# EasyEDA Pro project RM_超级电容控制板.eprj, board PCB_超电控制板
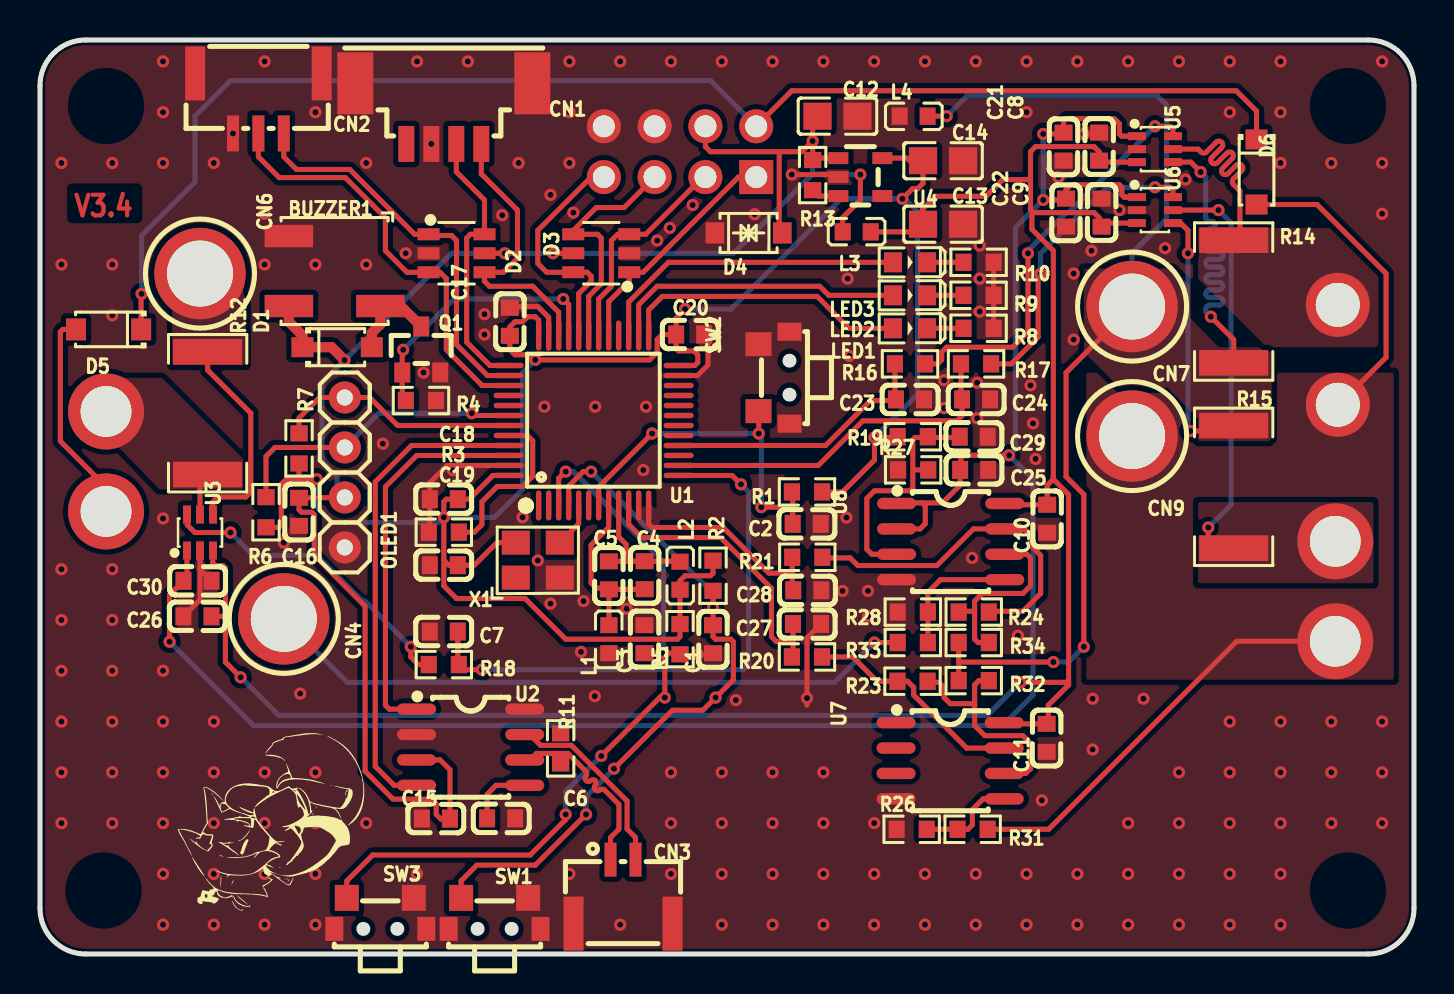
[diagram p3: board, top side]
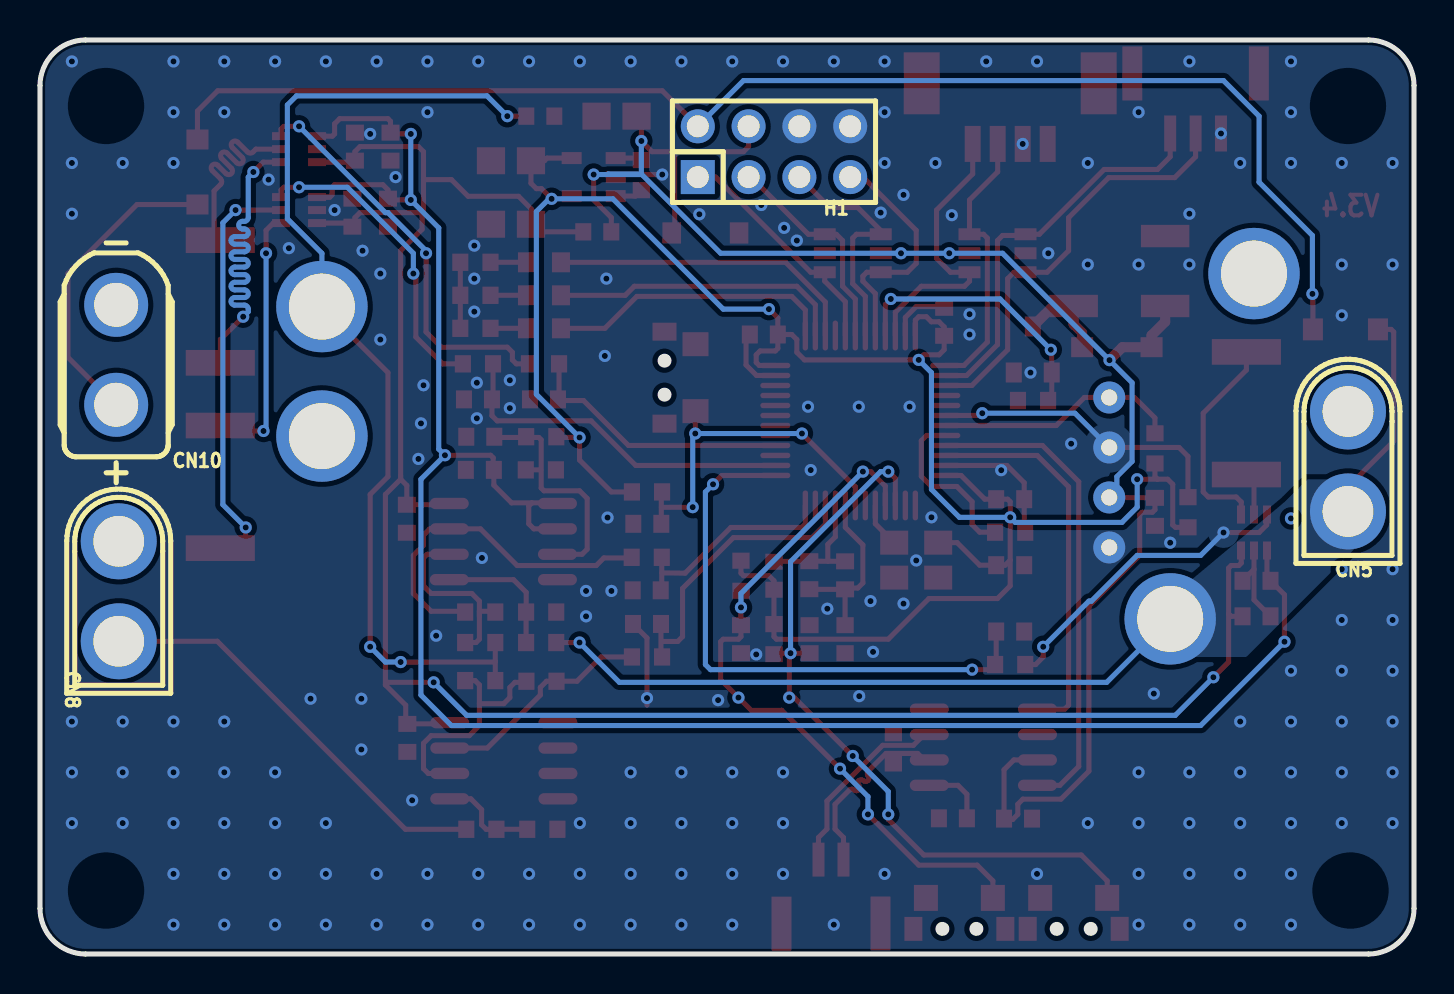
[diagram p4: board, bottom side, seen from below]

Outline 68.71 x 45.72 mm; copper layers: Top Layer, Bottom Layer. Coordinates in mm from the lower left corner of the outline.
Outline path: 0,43.43 arc(0.67,45.05) 2.29,45.72 66.42,45.72 arc(68.04,45.05) 68.71,43.43 68.71,2.29 arc(68.04,0.67) 66.42,0 2.29,0 arc(0.67,0.67) 0,2.29 0,43.43
Stack: Top Layer 0.035mm / Dielectric1 1.51mm FR4 er 4.5 / Bottom Layer 0.035mm

## Design rules (mm)
spacing Default (default): track to track 0.152, other pairs 0 to 0.152
track width Default (default): min 0.254, default 0.254, max 25.4
differential pair differentialPair (default): width min 0.127, default 0.254, max 2.54; gap min 0.152, default 0.152
via Default (default): diameter min 0.61, default 0.61, max 100.025; hole min 0.305, default 0.305, max 59.995
net VCUP uses gge254627
net GND uses gge260350(1)
net PGND uses gge210927
net PGND_IN uses gge210933
net PGND_OUT uses gge210996
net VCC uses gge211044
net PGND_CUP_IN uses gge253829
net PGND_CUP uses gge254615
pour e100 uses gge254627
pour e734 uses gge253829
pour e735 uses gge254615

## Placement (name value [footprint] x y rotation side)
BUZZER1  MLT-5020  [BUZ-SMD_3P-L5.2-W5.2-P3.50-BR]  14.73 34.16 90 top
C1  1nF  [C0603]  33.66 15.75 90 top
C2  1uF  [C0603]  38.34 21.52 180 top
C3  1nF  [C0603]  30.23 15.75 270 top
C4  1nF  [C0603]  30.24 18.95 90 top
C5  100nF  [C0603]  28.45 18.94 90 top
C6  100nF  [C0603]  23.06 6.79 180 top
C7  2nF  [C0603]  20.19 16.13 0 top
C8  100nF  [C0603]  52.96 40.39 270 top
C9  100nF  [C0603]  53.09 37.08 270 top
C10  100nF  [C0603]  50.36 21.77 90 top
C11  100nF  [C0603]  50.34 10.81 90 top
C12  22uF  [C0805]  39.88 41.91 0 top
C13  22uF  [C0805]  45.16 36.5 0 top
C14  22uF  [C0805]  45.16 39.68 0 top
C15  100nF  [C0603]  19.8 6.77 0 top
C16  100nF  [C0603]  12.95 22.12 90 top
C17  100nF  [C0603]  23.5 31.62 270 top
C18  100nF  [C0603]  20.19 22.75 0 top
C19  100nF  [C0603]  20.19 19.45 0 top
C20  100nF  [C0603]  32.51 30.99 180 top
C21  100nF  [C0603]  51.18 40.39 90 top
C22  100nF  [C0603]  51.31 37.08 90 top
C23  2nF  [C0603]  43.5 27.74 180 top
C24  2nF  [C0603]  46.81 27.74 180 top
C25  100nF  [C0603]  46.71 24.22 0 top
C26  100nF  [C0603]  7.87 16.89 0 top
C27  2nF  [C0603]  38.35 16.51 180 top
C28  2nF  [C0603]  38.37 18.19 180 top
C29  100nF  [C0603]  46.69 25.88 180 top
C30  100nF  [C0603]  7.87 18.67 180 top
CN1  1.25-4PWB  [CONN-SMD_1.25-4PWB]  20.19 42.04 180 top
CN2  GH1.25-3PWBPZ  [CONN-SMD_GH1.25-3PWBPZ]  10.92 42.55 180 top
CN3  GH1.25-2PWBPZ  [CONN-SMD_GH1.25-2PWBPZ]  29.15 3.12 0 top
CN4  m3焊盘  [M3焊盘]  12.19 16.76 90 top
CN5  XT30U-M  [CONN-TH_XT30U-M]  3.3 24.64 90 bottom
CN6  m3焊盘  [M3焊盘]  8 34.04 90 top
CN7  m3焊盘  [M3焊盘]  54.61 32.39 0 top
CN8  XT30U-M  [CONN-TH_XT30U-M]  64.77 18.14 90 bottom
CN9  m3焊盘  [M3焊盘]  54.61 25.91 0 top
CN10  XT30  [CONN-TH_XT30UPB-F]  64.9 29.97 90 bottom
D1  贴片二极管/JSPI3100A/SOD-123FL[捷捷微]  [SOD-123F_L2.7-W1.6-LS3.8-RD]  14.86 30.35 0 top
D2  IP4220CZ6  [SOT-23-6_L2.9-W1.6-P0.95-LS2.7-BL]  20.83 35.05 270 top
D3  IP4220CZ6  [SOT-23-6_L2.9-W1.6-P0.95-LS2.7-BL]  28.07 35.05 90 top
D4  SMFJ5.0CA  [SOD-123_L2.8-W1.8-LS3.7-BI]  35.43 36.07 180 top
D5  DSK310_C713648  [SOD-123_L2.7-W1.8-LS3.7-RD]  3.43 31.24 180 top
D6  DSK310_C713648  [SOD-123_L2.7-W1.8-LS3.7-RD]  60.83 39.12 270 top
H1  PZ254V-12-8P  [HDR-TH_8P-P2.54-V-M-R2-C4-S2.54]  32 40.13 180 bottom
L1  1m  [L0603]  28.45 15.75 90 top
L2  1m  [L0603]  32 18.92 270 top
L3  1m  [L0603]  40.84 36.12 0 top
L4  1m  [L0603]  43.69 41.91 180 top
LED1  LED-0603_R  [LED0603_RED]  43.5 31.3 0 top
LED2  LED-0603_G  [LED0603_RED]  43.51 32.95 0 top
LED3  LED-0603_B  [LED0603_RED]  43.51 34.6 0 top
OLED1  0.96OLED_4P_MODULE_JX  [排针2.54单排4PIN]  15.24 20.34 90 top
Q1  2N7002  [SOT-23_L2.9-W1.3-P0.95-LS2.4-BR]  19.06 30.24 270 top
R1  10k  [R0603]  38.35 23.11 180 top
R2  10k  [R0603]  33.66 18.92 90 top
R3  1k  [R0603]  20.19 21.1 180 top
R4  10k  [R0603]  19.05 27.69 180 top
R5  10k  [R0603]  32 15.75 90 top
R6  10k  [R0603]  11.3 22.1 90 top
R7  10k  [R0603]  12.95 25.29 90 top
R8  100  [R0603]  46.93 31.3 0 top
R9  100  [R0603]  46.93 32.95 0 top
R10  100  [R0603]  46.93 34.6 0 top
R11  120  [R0603]  26.03 10.29 270 top
R12  1mΩ  [R2512]  8.38 27.05 270 top
R13  10k  [R0603]  38.64 38.96 90 top
R14  1mΩ  [R2512]  59.69 32.64 90 top
R15  1mΩ  [R2512]  59.69 23.37 270 top
R16  160  [R0603]  43.5 29.52 0 top
R17  160  [R0603]  46.81 29.52 0 top
R18  160  [R0603]  20.19 14.48 180 top
R19  2k  [R0603]  43.64 25.88 0 top
R20  160  [R0603]  38.35 14.86 0 top
R21  160  [R0603]  38.37 19.84 0 top
R23  3k3  [R0603]  43.63 13.64 0 top
R24  3k3  [R0603]  46.69 17.1 180 top
R26  3k3  [R0603]  43.59 6.24 0 top
R27  2k  [R0603]  43.66 24.22 180 top
R28  3k3  [R0603]  43.65 17.1 0 top
R31  68k  [R0603]  46.64 6.24 180 top
R32  68k  [R0603]  46.69 13.68 180 top
R33  68k  [R0603]  43.65 15.58 0 top
R34  68k  [R0603]  46.69 15.58 0 top
SW1  TS24CA  [SW-SMD_TS24CA]  22.73 2.03 180 top
SW2  TS24CA  [SW-SMD_TS24CA]  36.7 28.83 270 top
SW3  TS24CA  [SW-SMD_TS24CA]  17.02 2.03 180 top
U1  STM32F334C8T6  [LQFP-48_L7.0-W7.0-P0.50-LS9.0-BL]  27.69 26.69 0 top
U2  TJA1050T/CM,118  [SOIC-8_L5.0-W4.0-P1.27-LS6.0-BL]  21.53 10.34 270 top
U3  INA199A2DCKR  [SOT-363_L2.0-W1.3-P0.65-LS2.1-BR]  8 21.08 270 top
U4  RT9193-33  [SOT-23-5_L2.9-W1.6-P0.95-LS2.8-BL]  41.02 38.86 270 top
U5  INA199A2DCKR  [SOT-363_L2.0-W1.3-P0.65-LS2.1-BR]  55.75 40.26 180 top
U6  INA199A2DCKR  [SOT-363_L2.0-W1.3-P0.65-LS2.1-BR]  55.75 37.21 180 top
U7  GS8552-SR  [SOIC-8_L5.0-W4.0-P1.27-LS6.0-BL]  45.51 9.67 270 top
U8  GS8552-SR  [SOIC-8_L5.0-W4.0-P1.27-LS6.0-BL]  45.54 20.63 270 top
X1  8MHz  [OSC-SMD_4P-L3.2-W2.5-BL]  24.89 19.7 0 top

## Footprints (pads in the part's own frame, mm; a bottom-side part is the same pattern mirrored in y, then rotated)
BUZ-SMD_3P-L5.2-W5.2-P3.50-BR
  rect 1.12x2.425 smd: 1(1.75,2.288) 2(-1.75,2.288) 3(-1.75,-2.288)
C0603
  rect 0.8x0.9 smd: 1(-0.7,0) 2(0.7,0)
C0805
  rect 1.41x1.35 smd: 1(-1,0) 2(1,0)
CONN-SMD_1.25-4PWB
  rect 0.8x1.8 smd: 1(-1.875,1.516) 2(-0.625,1.516) 3(0.625,1.516) 4(1.875,1.516)
  rect 1.8x3.1 smd: 5(-4.425,-1.516) 6(4.425,-1.516)
CONN-SMD_GH1.25-2PWBPZ
  rect 0.6x1.7 smd: 1(-0.625,1.602) 2(0.625,1.602)
  rect 1x2.7 smd: 3(2.475,-1.602) 4(-2.475,-1.598)
CONN-SMD_GH1.25-3PWBPZ
  rect 0.6x1.8 smd: 1(-1.27,1.501) 2(0,1.501) 3(1.27,1.501)
  rect 1x2.7 smd: 4(-3.163,-1.501) 5(3.163,-1.501)
CONN-TH_XT30U-M
  round 3.8 hole 2.54: 1(-2.5,0) 2(2.5,0)
CONN-TH_XT30UPB-F
  round 3.2 hole 2.2: 1(-2.5,0) 2(2.5,0)
HDR-TH_8P-P2.54-V-M-R2-C4-S2.54
  rect 1.7x1.7 hole 1.1: 1(-3.81,-1.27)
  round 1.7 hole 1.1: 2(-3.81,1.27) 3(-1.27,-1.27) 4(-1.27,1.27) 5(1.27,-1.27) 6(1.27,1.27) 7(3.81,-1.27) 8(3.81,1.27)
L0603
  rect 0.8x0.864 smd: 1(-0.7,0) 2(0.7,0)
LED0603_RED
  rect 0.9x1 smd: 1(-0.85,0) 2(0.85,0)
LQFP-48_L7.0-W7.0-P0.50-LS9.0-BL
  oval 0.27x1.5 smd: 1(-2.75,-4.25) 2(-2.25,-4.25) 3(-1.75,-4.25) 4(-1.25,-4.25) 5(-0.75,-4.25) 6(-0.25,-4.25) 7(0.25,-4.25) 8(0.75,-4.25) 9(1.25,-4.25) 10(1.75,-4.25) 11(2.25,-4.25) 12(2.75,-4.25) 25(2.75,4.25) 26(2.25,4.25) 27(1.75,4.25) 28(1.25,4.25) 29(0.75,4.25) 30(0.25,4.25) 31(-0.25,4.25) 32(-0.75,4.25) 33(-1.25,4.25) 34(-1.75,4.25) 35(-2.25,4.25) 36(-2.75,4.25)
  oval 1.5x0.27 smd: 13(4.25,-2.75) 14(4.25,-2.25) 15(4.25,-1.75) 16(4.25,-1.25) 17(4.25,-0.75) 18(4.25,-0.25) 19(4.25,0.25) 20(4.25,0.75) 21(4.25,1.25) 22(4.25,1.75) 23(4.25,2.25) 24(4.25,2.75) 37(-4.25,2.75) 38(-4.25,2.25) 39(-4.25,1.75) 40(-4.25,1.25) 41(-4.25,0.75) 42(-4.25,0.25) 43(-4.25,-0.25) 44(-4.25,-0.75) 45(-4.25,-1.25) 46(-4.25,-1.75) 47(-4.25,-2.25) 48(-4.25,-2.75)
M3焊盘
  round 4.572 hole 3.302: 1(0,0)
OSC-SMD_4P-L3.2-W2.5-BL
  rect 1.4x1.2 smd: 1(-1.1,-0.875) 2(1.1,-0.875) 3(1.1,0.875) 4(-1.1,0.875)
R0603
  rect 0.806x0.864 smd: 1(-0.753,0) 2(0.753,0)
R2512
  rect 1.282x3.456 smd: 1(-3.067,0) 2(3.067,0)
SOD-123_L2.7-W1.8-LS3.7-RD
  rect 1x1.1 smd: 1(-1.627,0) 2(1.627,0)
SOD-123_L2.8-W1.8-LS3.7-BI
  rect 0.93x1.06 smd: 1(1.685,0) 2(-1.685,0)
SOD-123F_L2.7-W1.6-LS3.8-RD
  rect 1.1x1 smd: 1(-1.735,0) 2(1.735,0)
SOIC-8_L5.0-W4.0-P1.27-LS6.0-BL
  oval 0.569x1.95 smd: 1(-1.905,-2.705) 2(-0.635,-2.705) 3(0.635,-2.705) 4(1.905,-2.705) 5(1.905,2.705) 6(0.635,2.705) 7(-0.635,2.705) 8(-1.905,2.705)
SOT-23-5_L2.9-W1.6-P0.95-LS2.8-BL
  rect 0.6x1 smd: 1(-0.95,-1.1) 2(0,-1.1) 3(0.95,-1.1) 4(0.95,1.1) 5(-0.95,1.1)
SOT-23-6_L2.9-W1.6-P0.95-LS2.7-BL
  rect 0.6x1.1 smd: 1(-0.95,-1.4) 2(0,-1.4) 3(0.95,-1.4) 4(0.95,1.4) 5(0,1.4) 6(-0.95,1.4)
SOT-23_L2.9-W1.3-P0.95-LS2.4-BR
  rect 1x0.8 smd: 1(1.15,-0.95) 2(1.15,0.95) 3(-1.15,0)
SOT-363_L2.0-W1.3-P0.65-LS2.1-BR
  rect 0.9x0.4 smd: 1(0.9,-0.65) 2(0.9,0) 3(0.9,0.65) 4(-0.9,0.65) 5(-0.9,0) 6(-0.9,-0.65)
SW-SMD_TS24CA
  rect 0.9x1.2 smd: 1(-2.3,0.775) 2(2.3,0.775)
  rect 1.2x1.3 smd: 3(-1.675,-0.775) 4(1.675,-0.775)
排针2.54单排4PIN
  round 1.6 hole 0.805x0.8: 1(0,0.001) 2(2.5,0.001) 3(5,0.001) 4(7.5,0.001)

## Nets
As in the schematic, except:
HRTIM1_CHA1: D3.1 H1.1 U1.29
HRTIM1_CHA2: D3.3 H1.3 U1.30
LEDB: LED3.1 U1.27
LEDG: LED2.1 U1.26
LEDR: LED1.1 U1.25

Pads without a net: CN1 4; U1 1 2 6 11 15 17 18 19 20 21 22 28 40 41; U4 4; U7 1 2 3; X1 1

## Via types
v1: diameter 0.61, hole 0.305, Top Layer to Bottom Layer, 243 vias

## Routing (per net, layer and track width the routed paths; a pad name or vN(x,y) marks a point on that pad's centre or on a via; arc(x,y) is an arc through that point)
1.65V: length 102.2
  Top Layer w0.254: v1(48.46,24.95) 46.17,24.95 46.04,24.82 46.04,24.25 46.01,24.22 46.01,23.45 45.13,22.57 44.11,22.57 ; U8.1 42.9,22.53 ; v1(6.48,15.62) 6.48,17.97 C30.2 7.35,18.85 U3.1 ; 54.21,37.86 54.34,37.86 ; 54.21,37.86 54.85,37.86 ; 54.21,37.86 54.1,37.97 54.1,38.35 53.97,38.48 51.56,38.48 51.31,38.23 C22.2 51.24,37.72 v1(50.16,37.72) ; 54.34,37.86 54.85,37.86 ; v1(50.16,41.02) 51.12,41.02 C21.2 51.18,41.66 51.31,41.78 53.72,41.78 53.97,41.53 53.97,41.02 54.09,40.91 54.85,40.91 ; U8.2 44.01,21.27 44.27,21.52 44.27,22.41 44.11,22.57 42.86,22.57
  Bottom Layer w0.254: v1(6.48,15.62) 10.67,11.43 48.13,11.43 49.66,12.95 49.66,23.75 v1(48.46,24.95) 48.77,25.26 48.77,36.32 v1(50.16,37.72) v1(50.16,41.02)
3V3: length 109.7
  Top Layer w0.254: 24.94,30.94 24.94,31.71 24.76,31.88 24.38,31.88 24.13,31.62 23.75,31.62 23.5,31.37 23.5,30.23 23.75,29.97 24.51,29.97 v1(24.76,29.72) 30.48,29.72 30.86,30.1 30.86,30.73 31.12,30.99 C20.2 ; 23.79,20.58 22.84,20.58 21.72,19.45 20.45,19.45 20.19,19.7 ; 42.89,25.87 42.85,25.84 v1(41.73,25.84) 41.73,24.71 40.13,23.11 R1.1 ; R6.1 11.93,21.34 12.06,21.46 12.06,23.5 12.32,23.75 12.83,23.75 ; v1(32.26,32.26) 31.81,31.81 C20.2 ; R7.1 12.95,23.88 12.83,23.75 ; 23.44,23.94 22.65,23.94 21.46,22.75 20.32,22.75 20.19,22.62 20.19,19.7 ; 12.83,23.75 v1(13.84,23.75) ; C20.2 31.81,30.29 31.94,30.17 32.7,30.17 32.89,29.97 32.89,29.59 32.74,29.44 U1.24 ; U4.5 43.35,39.81 43.48,39.68 C14.1 44.16,38.55 43.89,38.28 43.63,38.28 v1(43.12,37.78) ; 20.19,19.7 20.19,18.42 20.83,17.78 24.26,17.78 26.29,15.75 31.88,15.75 32,15.88 R5.2 32,18.67 32.26,18.92 33.53,18.92 33.66,19.05 33.66,19.68
  Bottom Layer w0.254: v1(24.76,29.72) 24.13,29.08 24.13,23.24 22.73,21.84 v1(20.19,21.84) 19.94,21.59 14.61,21.59 13.84,22.35 v1(13.84,23.75) ; v1(41.73,25.84) 43.89,28 43.89,37.14 43.25,37.78 v1(43.12,37.78) 40.06,37.78 34.54,32.26 v1(32.26,32.26)
+5V: length 92.8
  Top Layer w0.254: v1(25.65,35.05) D3.5 ; v1(41.02,38.99) 41.02,37.72 40.14,36.83 40.14,36.12 ; 15.24,22.84 C16.2 ; C12.1 38.64,41.67 R13.2 ; U4.1 38.73,39.81 38.64,39.72 ; 18.83,9.71 20.01,9.71 20.5,9.22 C15.2 20.46,6.73 20.07,6.73 19.81,6.98 19.81,7.49 19.56,7.75 17.65,7.75 16.26,9.14 16.26,17.4 13.72,19.94 13.72,21.97 13.59,22.1 13.08,22.1 12.95,22.22 12.95,22.81 ; D4.2 36.97,36.22 36.97,40.13 ; H1.4 33.27,40.39 33.53,40.13 38.1,40.13 v1(38.64,40.67) ; D2.5 v1(23.24,35.05)
  Top Layer w0.508: v1(15.23,29.71) 14.58,30.35 D1.1 13.12,30.94 12.44,31.63 BUZZER1.2
  Bottom Layer w0.254: v1(41.02,38.99) 38.64,38.99 v1(38.64,40.67) ; 15.24,22.84 14.86,23.22 14.86,23.88 14.1,24.64 14.1,28.58 v1(15.23,29.71) 20.57,35.05 v1(23.24,35.05) v1(25.65,35.05) ; v1(25.65,35.05) 34.67,35.05 38.64,39.02 40.29,39.02 40.31,38.99 ; v1(25.65,35.05) 25.62,35.05
AVCC: length 108.1
  Top Layer w0.254: 51.44,13.46 50.42,12.45 50.42,11.59 C11.2 ; 51.44,13.46 51.44,22.99 50.67,23.75 ; 51.44,13.46 51.31,13.59 v1(49.02,13.59) ; 8.58,16.89 9.14,16.89 9.27,17.02 ; 8.65,20.18 8.64,19.56 8.76,19.43 9.14,19.43 9.27,19.3 9.27,17.02 ; 49.53,38.73 49.53,37.21 49.66,37.08 52.71,37.08 52.96,36.83 52.96,36.38 ; 49.53,38.73 48.13,38.73 47.3,37.9 44.78,37.9 44.14,37.27 C13.1 44.16,36.12 41.54,36.12 ; 49.53,38.73 49.53,40.13 49.78,40.39 52.71,40.39 52.96,40.13 52.96,39.69 ; C10.2 48.3,22.47 U8.8 ; 54.47,36.56 53.01,36.56 52.83,36.38 C9.2 ; 9.27,17.02 9.27,14.61 v1(10.03,13.84) ; 52.83,39.61 52.91,39.69 C8.2 52.96,39.61 54.47,39.61 ; 50.67,23.75 50.67,23.92 ; 50.67,23.75 50.67,35.18 49.6,36.25 49.6,37.14 ; 50.67,23.75 50.36,23.44 50.36,22.47 ; 50.34,11.51 48.28,11.51 48.22,11.57
  Bottom Layer w0.254: v1(10.03,13.84) 11.94,11.94 47.37,11.94 v1(49.02,13.59)
GND: length 27.8
  Top Layer w0.254: 19.44,21.1 19.49,21.15 19.49,23.57 20.36,24.44 U1.47 ; C26.1 8,17.72 8,19.24 ; C27.1 38.35,15.81 v1(38.35,12.8) 38.35,12.45 ; R8.2 R10.2 ; 8,19.24 C30.1 ; 8,19.24 U3.2 ; C20.1 33.4,30.99 33.4,29.46 32.88,28.94 U1.23 ; 25.44,30.94 25.44,31.84 24.89,32.39 23.56,32.39 C17.1 ; U4.2 39.79,38.99 v1(37.59,38.99)
  vias: v1(1.07,39.57) v1(1.07,34.49) v1(1.07,19.25) v1(1.07,16.71) v1(1.07,14.17) v1(1.07,11.63) v1(1.07,9.09) v1(1.07,6.55) v1(3.61,39.57) v1(3.61,34.49) v1(3.61,31.95) v1(3.61,19.25) v1(3.61,16.71) v1(3.61,14.17) v1(3.61,11.63) v1(3.61,9.09) v1(3.61,6.55) v1(6.15,44.65) v1(6.15,42.11) v1(6.15,39.57) v1(6.15,21.79) v1(6.15,14.17) v1(6.15,11.63) v1(6.15,9.09) v1(6.15,6.55) v1(6.15,4.01) v1(6.15,1.47) v1(8.69,39.57) v1(8.69,11.63) v1(8.69,9.09) v1(8.69,6.55) v1(8.69,4.01) v1(8.69,1.47) v1(9.65,41.04) v1(11.23,44.65) v1(11.23,37.03) v1(11.23,34.49) v1(11.23,9.09) v1(11.23,6.55) v1(11.23,4.01) v1(11.23,1.47) v1(12.19,20.57) v1(13.01,13.03) v1(13.77,42.11) v1(13.77,34.49) v1(13.77,9.09) v1(13.77,6.55) v1(13.77,4.01) v1(13.77,1.47) v1(16.31,39.57) v1(16.31,34.49) v1(16.31,6.55) v1(17.14,25.53) v1(18.29,35.05) v1(18.85,44.65) v1(18.85,4.01) v1(19.18,29.08) v1(19.57,40.52) v1(20.64,24.2) v1(21.39,44.65) v1(22.22,32) v1(22.22,30.99) v1(23.11,36.96) v1(23.93,39.57) v1(24.13,21.84) v1(24.89,19.69) v1(25.22,27.38) v1(25.53,37.97) v1(25.53,17.53) v1(26.47,44.65) v1(26.47,42.11) v1(26.47,39.57) v1(26.47,4.01) v1(26.67,37.08) v1(27.05,15.11) v1(27.18,17.65) v1(27.74,12.9) v1(27.76,27.38) v1(29.01,44.65) v1(29.01,1.47) v1(29.34,17.27) v1(30.17,24.21) v1(30.3,27.38) v1(30.86,35.69) v1(31.5,36.32) v1(31.55,44.65) v1(31.55,9.09) v1(31.55,6.55) v1(31.55,4.01) v1(32.64,37.47) v1(32.89,14.99) v1(34.09,44.65) v1(34.09,9.09) v1(34.09,6.55) v1(34.09,4.01) v1(34.09,1.47) v1(34.8,12.7) v1(35.74,37) v1(36.63,44.65) v1(36.63,9.09) v1(36.63,6.55) v1(36.63,4.01) v1(36.63,1.47) v1(39.17,44.65) v1(39.17,9.09) v1(39.17,6.55) v1(39.17,4.01) v1(39.17,1.47) v1(40.13,18.16) v1(40.33,21.83) v1(40.39,33.78) v1(40.46,29.92) v1(41.4,18.16) v1(41.4,16.89) v1(41.71,44.65) v1(41.71,6.55) v1(41.71,4.01) v1(41.71,1.47) v1(44.25,44.65) v1(44.25,4.01) v1(44.25,1.47) v1(45.21,28.7) v1(45.21,27.31) v1(46.61,19.81) v1(46.79,44.65) v1(46.79,4.01) v1(46.79,1.47) v1(46.86,28.58) v1(46.86,26.8) v1(46.99,35.43) v1(46.99,33.78) v1(46.99,32.13) v1(48.9,15.92) v1(49.33,44.65) v1(49.33,42.11) v1(49.33,4.01) v1(49.33,1.47) v1(49.53,28.45) v1(49.66,26.54) v1(49.78,24.77) v1(50.1,7.69) v1(50.93,38.86) v1(51.69,34.04) v1(51.69,30.73) v1(51.87,44.65) v1(51.87,4.01) v1(51.87,1.47) v1(52.2,41.02) v1(52.58,35.18) v1(52.64,12.77) v1(52.64,10.23) v1(53.97,37.21) v1(54.41,44.65) v1(54.41,6.55) v1(54.41,4.01) v1(54.41,1.47) v1(55.18,12.77) v1(56.26,35.31) v1(56.95,44.65) v1(56.95,9.09) v1(56.95,6.55) v1(56.95,4.01) v1(56.95,1.47) v1(57.28,38.73) v1(59.49,44.65) v1(59.49,42.11) v1(59.49,11.63) v1(59.49,9.09) v1(59.49,6.55) v1(59.49,4.01) v1(59.49,1.47) v1(62.03,44.65) v1(62.03,42.11) v1(62.03,39.57) v1(62.03,11.63) v1(62.03,9.09) v1(62.03,6.55) v1(62.03,4.01) v1(62.03,1.47) v1(64.57,39.57) v1(64.57,11.63) v1(64.57,9.09) v1(64.57,6.55) v1(67.11,44.65) v1(67.11,39.57) v1(67.11,37.03) v1(67.11,11.63) v1(67.11,9.09) v1(67.11,6.55)
PGND: length 83.3
  Top Layer w0.254: R15.1 59.42,26.16 v1(57.53,26.16) ; 56.65,36.56 57.04,36.56 57.4,36.19 v1(57.4,35.05) ; v1(58.55,31.88) 59.69,30.73 R14.1 ; R32.2 45.94,15.58 ; 45.94,14.6 v1(50.67,14.61) ; L4.1 v1(45.34,41.91) ; 45.94,14.65 45.95,14.66 ; 56.65,39.61 57.55,39.61 v1(58.04,39.12) ; CN7.1 51.31,29.08 51.31,23.88 52.2,22.99 v1(52.2,15.37)
  Bottom Layer w0.254: v1(52.2,15.37) 51.44,14.61 v1(50.67,14.61) ; CN7.1 54.61,35.05 56.34,36.78 56.34,42.47 55.88,42.93 46.35,42.93 v1(45.34,41.91) ; v1(57.53,26.16) 57.4,26.29 v1(57.4,35.05) ; v1(58.04,39.12) 58.29,38.86 58.29,36.84 arc(58.35,36.7) 58.48,36.65 58.58,36.65 arc(58.77,36.46) 58.58,36.27 58.48,36.27 arc(58.29,36.08) 58.48,35.89 58.97,35.89 arc(59.16,35.7) 58.97,35.51 58.48,35.51 arc(58.29,35.31) 58.48,35.12 58.97,35.12 arc(59.16,34.93) 58.97,34.74 58.48,34.74 arc(58.29,34.55) 58.48,34.36 58.97,34.36 arc(59.16,34.17) 58.97,33.98 58.48,33.98 arc(58.29,33.79) 58.48,33.6 58.97,33.6 arc(59.16,33.41) 58.97,33.22 58.48,33.22 arc(58.29,33.03) 58.48,32.84 58.97,32.84 arc(59.16,32.65) 58.97,32.46 58.48,32.46 arc(58.35,32.4) 58.29,32.27 58.29,32.13 v1(58.55,31.88)
PGND_CUP: length 10.6
  Top Layer w0.254: 8.65,21.98 8.64,22.61 8.89,22.86 10.29,22.86 10.54,23.11 10.54,27.05 8.38,29.21 8.38,30.12
PGND_CUP_IN: length 2.2
  Top Layer w0.254: R12.2 8,23.6 U3.5
PGND_IN: length 21
  Top Layer w0.254: R15.2 58.69,20.3 58.42,20.57 v1(58.42,21.34) ; v1(58.93,37.21) U6.5
  Bottom Layer w0.254: v1(58.42,21.34) 59.56,22.48 59.56,36.58 v1(58.93,37.21)
PGND_OUT: length 12.1
  Top Layer w0.254: R14.2 60,36.02 60,38.17 59.67,38.5 arc(59.62,38.63) 59.67,38.77 60.09,39.18 arc(60.09,39.45) 59.82,39.45 59.4,39.04 arc(59.13,39.04) 59.13,39.31 59.63,39.8 arc(59.63,40.07) 59.36,40.07 58.87,39.58 arc(58.6,39.58) 58.6,39.84 59.09,40.34 arc(59.09,40.61) 58.82,40.61 58.33,40.11 arc(58.19,40.06) 58.06,40.11 57.91,40.26 U5.5
VCC: length 36.8
  Top Layer w0.254: 47.39,6.24 50.43,6.24 59.84,15.64 CN8.1 ; D6.2 63.86,37.49 67.31,34.04 67.31,29.84 64.94,27.47 64.9,27.47
VCC1: length 69.1
  Top Layer w0.254: H1.2 37.59,43.18 59.82,43.18 60.83,42.16 D6.1 ; D5.1 5.06,33 v1(5.08,33.02)
  Bottom Layer w0.254: v1(5.08,33.02) 5.08,35.94 7.75,38.61 7.75,41.91 9.53,43.69 33.53,43.69 H1.2
ADC_ICUP: length 28.8
  Top Layer w0.254: 31.94,23.94 34.61,23.94 v1(35.05,23.5) ; C7.2 20.89,14.53 R18.1 21.2,14.22 v1(22.1,14.22)
  Bottom Layer w0.254: v1(35.05,23.5) 35.43,23.11 35.43,14.48 35.18,14.22 v1(22.1,14.22)
ADC_IIN: length 17.8
  Top Layer w0.254: U1.14 38.92,24.44 41.15,26.67 45.85,26.67 46.11,26.93 46.11,27.74 ; C24.2 46.05,27.8 R17.1
ADC_IOUT: length 13.7
  Top Layer w0.254: U1.16 39.28,25.44 41.53,27.69 42.75,27.69 C23.2 42.75,27.74 42.75,29.52
ADC_VCC: length 14.6
  Top Layer w0.254: C27.2 37.65,14.91 R20.1 ; U1.10 29.44,21.49 30.1,20.83 34.04,20.83 36.58,18.29 36.58,15.88 36.82,15.63 37.6,15.63
ADC_VCUP: length 10.8
  Top Layer w0.254: U1.12 30.44,21.51 30.61,21.34 34.16,21.34 36.45,19.05 37.62,19.06 ; 37.62,19.84 37.62,18.25 37.67,18.19
BUZZER: length 13.6
  Top Layer w0.254: R4.2 18.11,27.87 18.11,29.09 ; 26.44,30.94 26.44,32.49 v1(26.16,32.77) ; v1(18.16,30.23) 18.11,30.18 18.11,29.09
  Bottom Layer w0.254: v1(26.16,32.77) 20.7,32.77 v1(18.16,30.23)
BUZZER1_3: length 4.7
  Top Layer w0.508: 19.06,31.39 18.04,32.41 BUZZER1.3 17.02,31.5 16.59,31.07 D1.2
C4_1: length 8.9
  Top Layer w0.254: C5.1 28.45,18.31 27.81,18.31 27.56,18.56 27.56,20.47 28.44,21.34 U1.8 ; C5.1 30.23,18.24 C4.1 ; C5.1 L1.2
C6_2: length 3.3
  Top Layer w0.254: C6.2 22.36,7.99 22.8,8.44 U2.5
C29_2: length 12.2
  Top Layer w0.254: 45.92,25.84 44.32,25.84 ; 42.83,20 41.6,20 41.35,20.25 41.35,22.79 41.73,23.17 43.5,23.17 43.65,23.31 43.65,25.72 43.76,25.84 44.33,25.84 44.36,25.87 ; 44.42,24.22 43.66,24.22
CAN_N: length 9.6
  Top Layer w0.254: CN3.1 28.53,5.83 28.95,6.25 28.95,7.48 28.23,8.2 arc(28.11,8.25) 28,8.2 arc(27.76,8.2) 27.76,8.44 arc(27.81,8.55) 27.76,8.67 arc(27.65,8.72) 27.53,8.67 arc(27.3,8.67) 27.3,8.9 arc(27.34,9.02) 27.3,9.14 26.4,10.03 24.82,10.03 24.49,9.71 U2.6
CAN_P: length 9.6
  Top Layer w0.254: CN3.2 29.78,5.83 29.36,6.25 29.36,7.65 26.57,10.44 25.03,10.44 24.49,10.98 U2.7
CAN_RX: length 24.1
  Top Layer w0.254: U1.45 18.58,25.44 16.76,23.62 16.76,9.38 17.71,8.44 18.83,8.44
CAN_TX: length 19.4
  Top Layer w0.254: 18.83,12.25 17.47,12.25 17.27,12.45 17.27,23.37 18.84,24.94 U1.46
HRTIM1_CHA1: length 11.9
  Top Layer w0.254: 29.47,34.1 30.16,34.1 34.93,38.86 H1.1 ; 28.44,30.94 28.44,32.63 29.47,33.66 D3.1
HRTIM1_CHA2: length 11
  Top Layer w0.254: 27.94,30.94 27.94,32.76 28.57,33.4 28.57,35.69 28.89,36 D3.3 ; 29.47,36 30.29,36 33.15,38.86 H1.3
HRTIM1_CHB1: length 12
  Top Layer w0.254: 27.44,30.94 27.44,32.9 28.07,33.53 28.07,35.81 27.88,36 D3.4 26.67,36.19 27.81,37.34 29.21,37.34 H1.5
HRTIM1_CHB2: length 12.2
  Top Layer w0.254: 26.94,30.94 26.94,33.03 27.56,33.66 27.56,33.91 27.37,34.1 D3.6 25.33,34.1 24.89,34.54 24.89,36.19 27.56,38.86 H1.7
I2C_SCL: length 15.1
  Top Layer w0.254: R6.2 11.3,24.89 11.75,25.34 15.24,25.34 ; 23.44,26.94 21.7,26.94 v1(21.59,27.05)
  Bottom Layer w0.254: v1(21.59,27.05) 16.95,27.05 15.24,25.34
I2C_SDA: length 12.3
  Top Layer w0.254: R7.2 12.95,26.81 13.98,27.84 OLED1.4 16.48,27.84 17.89,26.44 23.44,26.44
KEY1: length 36.2
  Top Layer w0.254: v1(27.31,6.98) 24.76,4.44 21.84,4.44 21.06,3.66 SW1.4 ; U1.4 26.44,23.41 27.16,24.13 v1(27.56,24.13) ; R2.1 v1(33.66,17.34) C1.2 33.66,15.88 33.78,15.75 34.54,15.75 34.67,15.62 34.67,13.72 v1(33.78,12.83) 33.15,12.19 31.62,12.19 v1(28.7,9.27)
  Bottom Layer w0.254: v1(28.7,9.27) 27.31,7.87 v1(27.31,6.98) ; v1(27.56,24.13) 33.66,18.03 v1(33.66,17.34)
KEY2: length 38.8
  Top Layer w0.254: U1.3 25.94,23.79 26.27,24.13 v1(26.29,24.13) ; 15.34,2.81 15.34,3.02 ; SW3.4 15.34,3.66 16.64,4.95 24.51,4.95 26.29,6.73 v1(26.29,6.98) ; v1(31.18,15.05) C3.2 ; v1(31.18,15.05) 31.95,15.05 R5.1 ; v1(31.18,15.05) 31.24,14.98 v1(31.24,12.83) 30.99,12.83 v1(28.07,9.91)
  Bottom Layer w0.254: v1(26.29,24.13) 26.67,24.13 31.18,19.62 v1(31.18,15.05) ; v1(28.07,9.91) 26.29,8.13 v1(26.29,6.98)
L2_1: length 6.5
  Top Layer w0.254: 32.01,19.57 31.94,19.65 C4.2 ; 29.31,19.64 29.31,20.49 28.94,20.87 U1.9 ; 28.45,19.64 30.24,19.65
LEDB: length 15.7
  Top Layer w0.254: LED3.1 31.42,34.6 29.44,32.61 29.44,30.94
LEDG: length 15.1
  Top Layer w0.254: 29.94,30.94 29.94,32.48 30.86,33.4 38.99,33.4 39.44,32.95 LED2.1 42.36,32.95
LEDR: length 14.4
  Top Layer w0.254: LED1.1 40.46,31.3 38.86,32.89 31.12,32.89 30.44,32.21 30.44,30.94
R3_1: length 8.6
  Top Layer w0.254: U1.44 24.37,25.94 24.64,25.67 24.64,23.89 24.13,23.39 22.86,23.39 22.1,22.62 22.1,21.48 21.72,21.1 20.95,21.1
R8_1: length 1.8
  Top Layer w0.254: LED1.2 R8.1
R9_1: length 1.8
  Top Layer w0.254: 44.36,32.95 46.18,32.95
R10_1: length 1.8
  Top Layer w0.254: LED3.2 R10.1
R13_1: length 1.4
  Top Layer w0.254: U4.3 38.93,37.91 R13.1
R16_2: length 20.3
  Top Layer w0.254: U5.6 56.65,41.26 56.51,41.4 v1(55.75,41.4) ; 44.26,29.52 44.89,29.52 45.09,29.72 45.09,30.1 45.34,30.35 48.64,30.35 49.4,31.11 v1(49.4,35.05)
  Bottom Layer w0.254: v1(55.75,41.4) 51.44,37.08 51.31,37.08 49.4,35.18 v1(49.4,35.05)
R20_2: length 11.2
  Top Layer w0.254: R20.2 40.64,14.86 41.85,13.64 R23.1 43.38,13.64 43.69,13.33 43.69,12.95 46.34,10.3 U7.7
R23_2: length 11.8
  Top Layer w0.254: 47.45,13.68 46.95,13.68 46.74,13.46 46.74,11.43 47.24,10.92 49.15,10.92 49.53,10.54 49.53,9.27 49.29,9.03 U7.6 ; 46.74,12.52 45.52,12.52 45.21,12.83 45.21,13.33 44.96,13.59 44.44,13.59 R23.2
R24_1: length 17.6
  Top Layer w0.254: R24.1 47.49,17.14 49.15,17.14 50.04,18.03 50.04,19.94 49.53,20.45 49.53,20.95 49.22,21.27 U8.7 46.68,21.27 44.85,19.43 40.89,19.43 40.51,19.81 39.15,19.81 39.12,19.84
R24_2: length 9.6
  Top Layer w0.254: 48.24,20 49.35,20 49.53,19.81 49.53,18.42 49.15,18.03 47.12,18.03 46.74,17.65 46.74,16.89 ; 47.45,15.58 46.9,15.58 46.74,15.75 46.74,17.14 45.98,17.14 45.94,17.1
R26_2: length 5
  Top Layer w0.254: U7.5 47.16,7.76 46.62,7.22 46.62,6.46 46.4,6.24 R31.2 ; 45.88,6.24 44.34,6.24
RST: length 18.1
  Top Layer w0.254: v1(35.94,26.03) 35.94,27.14 SW2.4 ; 37.64,22.34 v1(36.07,22.35) ; U1.7 27.94,23.36 v1(30.61,26.03) ; R1.2 37.64,23.08 C2.2
  Bottom Layer w0.254: v1(30.61,26.03) v1(35.94,26.03) 36.07,25.91 v1(36.07,22.35)
SWCLK: length 13.9
  Top Layer w0.254: CN1.2 20.82,39.13 22.23,37.72 D2.6 21.52,36 21.34,35.81 21.34,30.61 22.5,29.44 U1.37
SWDIO: length 14.4
  Top Layer w0.254: 25.94,30.94 25.94,32.1 24.64,33.4 22.48,33.4 22.22,33.66 D2.4 23.18,34.1 23.88,34.8 23.88,37.21 22.07,39.02 CN1.1
U3_6: length 15.8
  Top Layer w0.254: 7.35,21.98 7.37,21.46 7.75,21.08 v1(9.53,21.08) ; v1(18.54,15.37) 18.54,14.86 18.92,14.48 R18.2
  Bottom Layer w0.254: v1(9.53,21.08) 10.67,19.94 13.84,19.94 16.13,17.65 16.26,17.65 v1(18.54,15.37)
U6_6: length 15.5
  Top Layer w0.254: v1(55.75,38.35) 56.51,38.35 56.65,38.22 U6.6 ; 47.56,29.52 48.57,29.52 49.91,30.86 49.91,33.91 v1(50.04,34.04)
  Bottom Layer w0.254: v1(50.04,34.04) 50.04,35.05 53.34,38.35 v1(55.75,38.35)
U8_5: length 6.6
  Top Layer w0.254: 44.4,17.1 44.39,18.09 45.03,18.72 U8.5 ; 44.4,15.58 44.4,17.11
USART2_RX: length 20
  Top Layer w0.254: 23.44,28.94 22.37,28.94 20.83,30.48 20.83,35.69 20.57,35.94 19.49,35.94 D2.1 18.74,36 15.49,39.24 12.83,39.24 12.19,39.88 CN2.1
USART2_TX: length 21.5
  Top Layer w0.254: U1.39 22.11,28.44 20.32,30.23 20.32,33.78 20,34.1 D2.3 18.35,34.1 17.27,35.18 17.27,36.83 15.27,38.84 11.96,38.84 10.92,39.88 CN2.2
VCUP: length 43.6
  Top Layer w0.254: 42.89,15.58 v1(41.73,15.58) ; 1.8,31.24 1.14,31.24 1.02,31.11 1.02,25.65 3.3,23.37 CN5.1
  Bottom Layer w0.254: 41.73,15.58 39.74,13.59 15.37,13.59 CN4.1
X1_3: length 2.3
  Top Layer w0.254: 25.99,20.58 26.94,21.52 U1.5

## Copper pours and planes (outline as drawn; the poured copper is in the pictures)
GND on Top Layer: -4.57,47.88 72.64,47.88 72.64,-3.81 -4.57,-3.81
GND on Bottom Layer: -2.92,50.04 76.07,50.04 76.07,-2.16 -2.92,-2.16
PGND on Top Layer: 52.2,34.29 52.2,30.11 53.99,28.32 56.38,28.32 57.91,26.78 57.91,25.65 61.47,25.65 61.59,25.78 61.59,30.1 61.34,30.35 58.94,30.35 57.53,31.8 57.53,33.4 56.64,34.29
PGND_CUP on Top Layer: 6.6,29.46 6.6,33.66 10.03,33.66 10.29,32.64 10.29,29.46
PGND_CUP_IN on Top Layer: 2.41,28.83 6.1,28.83 10.16,24.77 10.16,23.24 5.97,23.24 2.41,26.92
PGND_IN on Top Layer: 57.91,22.61 66.68,22.61 66.68,18.54 57.91,18.54
PGND_OUT on Top Layer: 57.91,36.32 64.52,36.32 67.06,33.78 67.06,30.61 66.8,30.35 61.34,30.35 57.91,33.78
VCC on Top Layer: 52.32,29.08 67.69,29.08 67.69,13.72 52.32,13.72
VCUP on Bottom Layer: 2.92,23.75 5.33,23.75 6.48,22.61 13.46,16.76 13.59,15.37 13.08,14.86 8.38,14.86 1.65,21.59

Small or netless copper shapes (teardrops, artwork), in the pictures only: 2 on Bottom Layer

## Text on the board
Top Layer: V3.4
